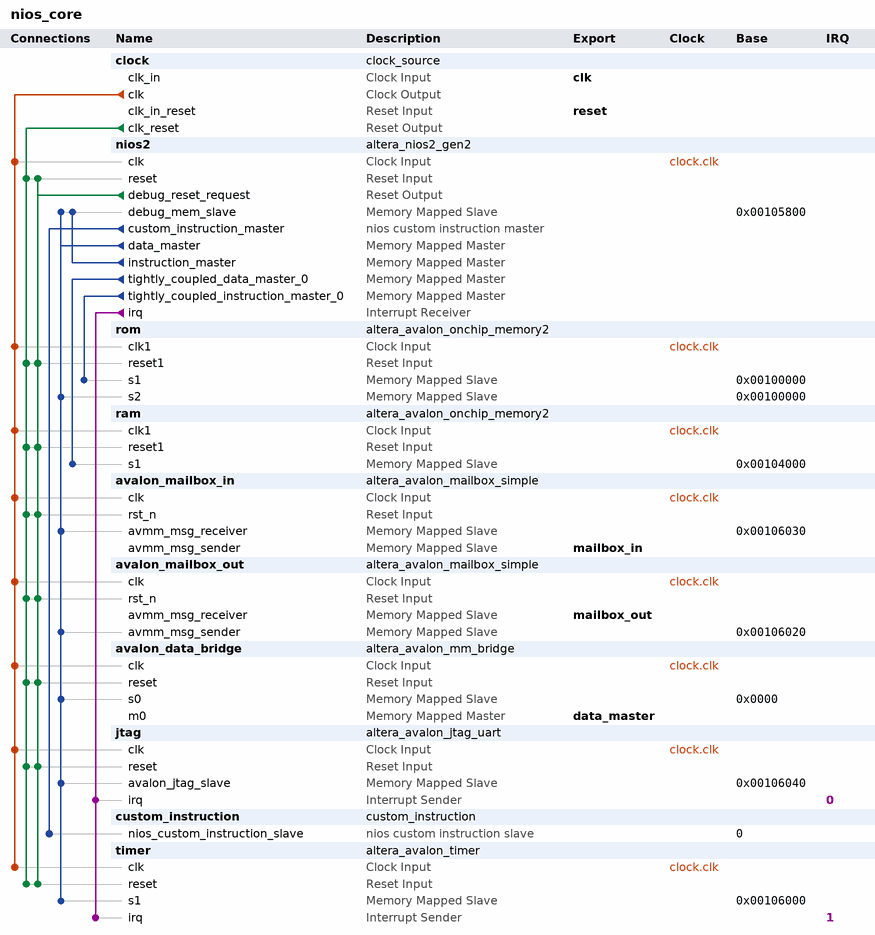
[diagram p0: system contents]
# Platform Designer (Qsys) system nios_core, Cyclone V 5CEBA2F17A7
# Parameters at their usual value, and those the tool derives, are not listed.
package require -exact qsys 18.1
create_system nios_core
set_project_property DEVICE_FAMILY {Cyclone V}
set_project_property DEVICE 5CEBA2F17A7

add_instance clock clock_source 18.1
set_instance_parameter_value clock clockFrequency 50000000

add_instance nios2 altera_nios2_gen2 18.1
set_instance_parameter_value nios2 dcache_bursts true
set_instance_parameter_value nios2 dcache_numTCDM 1
set_instance_parameter_value nios2 dcache_size 4096
set_instance_parameter_value nios2 exceptionSlave rom.s1
set_instance_parameter_value nios2 icache_numTCIM 1
set_instance_parameter_value nios2 icache_size 0
set_instance_parameter_value nios2 impl Fast
set_instance_parameter_value nios2 resetSlave rom.s1

add_instance rom altera_avalon_onchip_memory2 18.1
set_instance_parameter_value rom dataWidth 32
set_instance_parameter_value rom dualPort true
set_instance_parameter_value rom initMemContent false
set_instance_parameter_value rom initializationFileName onchip_mem.hex
set_instance_parameter_value rom memorySize 16384
set_instance_parameter_value rom singleClockOperation true

add_instance ram altera_avalon_onchip_memory2 18.1
set_instance_parameter_value ram dataWidth 32
set_instance_parameter_value ram dualPort false
set_instance_parameter_value ram initMemContent false
set_instance_parameter_value ram initializationFileName onchip_mem.hex
set_instance_parameter_value ram memorySize 4096

add_instance avalon_mailbox_in altera_avalon_mailbox_simple 18.1
set_instance_parameter_value avalon_mailbox_in AWIDTH 2
set_instance_parameter_value avalon_mailbox_in DWIDTH 32
set_instance_parameter_value avalon_mailbox_in MSG_ARRIVAL_NOTIFY 0
set_instance_parameter_value avalon_mailbox_in MSG_SPACE_NOTIFY 0

add_instance avalon_mailbox_out altera_avalon_mailbox_simple 18.1
set_instance_parameter_value avalon_mailbox_out AWIDTH 2
set_instance_parameter_value avalon_mailbox_out DWIDTH 32
set_instance_parameter_value avalon_mailbox_out MSG_ARRIVAL_NOTIFY 0
set_instance_parameter_value avalon_mailbox_out MSG_SPACE_NOTIFY 0

add_instance avalon_data_bridge altera_avalon_mm_bridge 18.1
set_instance_parameter_value avalon_data_bridge ADDRESS_UNITS SYMBOLS
set_instance_parameter_value avalon_data_bridge ADDRESS_WIDTH 20
set_instance_parameter_value avalon_data_bridge DATA_WIDTH 32
set_instance_parameter_value avalon_data_bridge MAX_PENDING_RESPONSES 4
set_instance_parameter_value avalon_data_bridge USE_AUTO_ADDRESS_WIDTH 0

add_instance jtag altera_avalon_jtag_uart 18.1
set_instance_parameter_value jtag simInteractiveOptions NO_INTERACTIVE_WINDOWS

add_instance custom_instruction custom_instruction 1.0

add_instance timer altera_avalon_timer 18.1
set_instance_parameter_value timer period 1
set_instance_parameter_value timer periodUnits MSEC

# connections
add_connection clock.clk avalon_data_bridge.clk clock
add_connection clock.clk avalon_mailbox_in.clk clock
add_connection clock.clk avalon_mailbox_out.clk clock
add_connection clock.clk jtag.clk clock
add_connection clock.clk nios2.clk clock
add_connection clock.clk ram.clk1 clock
add_connection clock.clk rom.clk1 clock
add_connection clock.clk timer.clk clock
add_connection clock.clk_reset avalon_data_bridge.reset reset
add_connection clock.clk_reset avalon_mailbox_in.rst_n reset
add_connection clock.clk_reset avalon_mailbox_out.rst_n reset
add_connection clock.clk_reset jtag.reset reset
add_connection clock.clk_reset nios2.reset reset
add_connection clock.clk_reset ram.reset1 reset
add_connection clock.clk_reset rom.reset1 reset
add_connection clock.clk_reset timer.reset reset
add_connection nios2.debug_reset_request avalon_data_bridge.reset reset
add_connection nios2.debug_reset_request avalon_mailbox_in.rst_n reset
add_connection nios2.debug_reset_request avalon_mailbox_out.rst_n reset
add_connection nios2.debug_reset_request jtag.reset reset
add_connection nios2.debug_reset_request nios2.reset reset
add_connection nios2.debug_reset_request ram.reset1 reset
add_connection nios2.debug_reset_request rom.reset1 reset
add_connection nios2.debug_reset_request timer.reset reset
add_connection nios2.data_master avalon_data_bridge.s0 avalon
set_connection_parameter_value nios2.data_master/avalon_data_bridge.s0 baseAddress 0x0000
add_connection nios2.data_master avalon_mailbox_in.avmm_msg_receiver avalon
set_connection_parameter_value nios2.data_master/avalon_mailbox_in.avmm_msg_receiver baseAddress 0x00106030
add_connection nios2.data_master avalon_mailbox_out.avmm_msg_sender avalon
set_connection_parameter_value nios2.data_master/avalon_mailbox_out.avmm_msg_sender baseAddress 0x00106020
add_connection nios2.data_master jtag.avalon_jtag_slave avalon
set_connection_parameter_value nios2.data_master/jtag.avalon_jtag_slave baseAddress 0x00106040
add_connection nios2.data_master nios2.debug_mem_slave avalon
set_connection_parameter_value nios2.data_master/nios2.debug_mem_slave baseAddress 0x00105800
add_connection nios2.data_master rom.s2 avalon
set_connection_parameter_value nios2.data_master/rom.s2 baseAddress 0x00100000
add_connection nios2.data_master timer.s1 avalon
set_connection_parameter_value nios2.data_master/timer.s1 baseAddress 0x00106000
add_connection nios2.instruction_master nios2.debug_mem_slave avalon
set_connection_parameter_value nios2.instruction_master/nios2.debug_mem_slave baseAddress 0x00105800
add_connection nios2.tightly_coupled_data_master_0 ram.s1 avalon
set_connection_parameter_value nios2.tightly_coupled_data_master_0/ram.s1 baseAddress 0x00104000
add_connection nios2.tightly_coupled_instruction_master_0 rom.s1 avalon
set_connection_parameter_value nios2.tightly_coupled_instruction_master_0/rom.s1 baseAddress 0x00100000
add_connection nios2.irq jtag.irq interrupt
set_connection_parameter_value nios2.irq/jtag.irq irqNumber 0
add_connection nios2.irq timer.irq interrupt
set_connection_parameter_value nios2.irq/timer.irq irqNumber 1
add_connection nios2.custom_instruction_master custom_instruction.nios_custom_instruction_slave nios_custom_instruction
set_connection_parameter_value nios2.custom_instruction_master/custom_instruction.nios_custom_instruction_slave CIName custom_instruction_0
set_connection_parameter_value nios2.custom_instruction_master/custom_instruction.nios_custom_instruction_slave baseAddress 0

# exported interfaces
add_interface clk clock sink
set_interface_property clk EXPORT_OF clock.clk_in
add_interface data_master avalon master
set_interface_property data_master EXPORT_OF avalon_data_bridge.m0
add_interface mailbox_in avalon slave
set_interface_property mailbox_in EXPORT_OF avalon_mailbox_in.avmm_msg_sender
add_interface mailbox_out avalon slave
set_interface_property mailbox_out EXPORT_OF avalon_mailbox_out.avmm_msg_receiver
add_interface reset reset sink
set_interface_property reset EXPORT_OF clock.clk_in_reset

set_interconnect_requirement {$system} qsys_mm.clockCrossingAdapter HANDSHAKE
set_interconnect_requirement {$system} qsys_mm.enableEccProtection FALSE
set_interconnect_requirement {$system} qsys_mm.insertDefaultSlave FALSE
set_interconnect_requirement {$system} qsys_mm.maxAdditionalLatency 1

save_system nios_core.qsys
